# Altium schematic sheet antennas.SchDoc
size Letter; Author: Ye-Sheng Kuo; Organization: Altium Limited; Address1: L3, 12a Rodborough Rd; Address2: Frenchs Forest; Address3: NSW; Address4: Australia 2086; Revision: 1
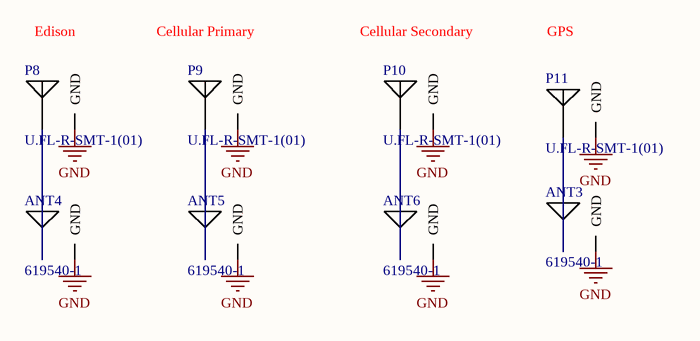
[diagram p0: antennas.SchDoc]

## Parts
ANT3  619540-1  [619540-1]
ANT4  619540-1  [619540-1]
ANT5  619540-1  [619540-1]
ANT6  619540-1  [619540-1]
P8  U.FL-R-SMT-1(01)  [U.FL-R-SMT-1(01)]
P9  U.FL-R-SMT-1(01)  [U.FL-R-SMT-1(01)]
P10  U.FL-R-SMT-1(01)  [U.FL-R-SMT-1(01)]
P11  U.FL-R-SMT-1(01)  [U.FL-R-SMT-1(01)]

## Nets
GND: ANT3.1(GND) ANT4.1(GND) ANT5.1(GND) ANT6.1(GND) P8.1(GND) P9.1(GND) P10.1(GND) P11.1(GND)
NetANT3_2: ANT3.2 P11.2
NetANT4_2: ANT4.2 P8.2
NetANT5_2: ANT5.2 P9.2
NetANT6_2: ANT6.2 P10.2

## Notes on the sheet
- Edison
- Cellular Primary
- Cellular Secondary
- GPS
- Title
- Date:
- Author:
- Revision:
- Sheet
- of
- University of Michigan
- File:

## Library data of the parts
ANT3-ANT6 = 619540-1: CONN SMA JACK; Supplier 1: Digi-Key; Supplier Part Number 1: A120734-ND
P8-P11 = U.FL-R-SMT-1(01): U.FL, Ultra Miniature Coaxial Connector Receptacle, Male Pin 50 Ohm Surface Mount Solder; Supplier 1: Digi-Key; Supplier Part Number 1: H122041-ND